# EAGLE design RC_MUX (EAGLE 6.4)
DATABASE: /home/mes/eagle/PARTSDB.txt
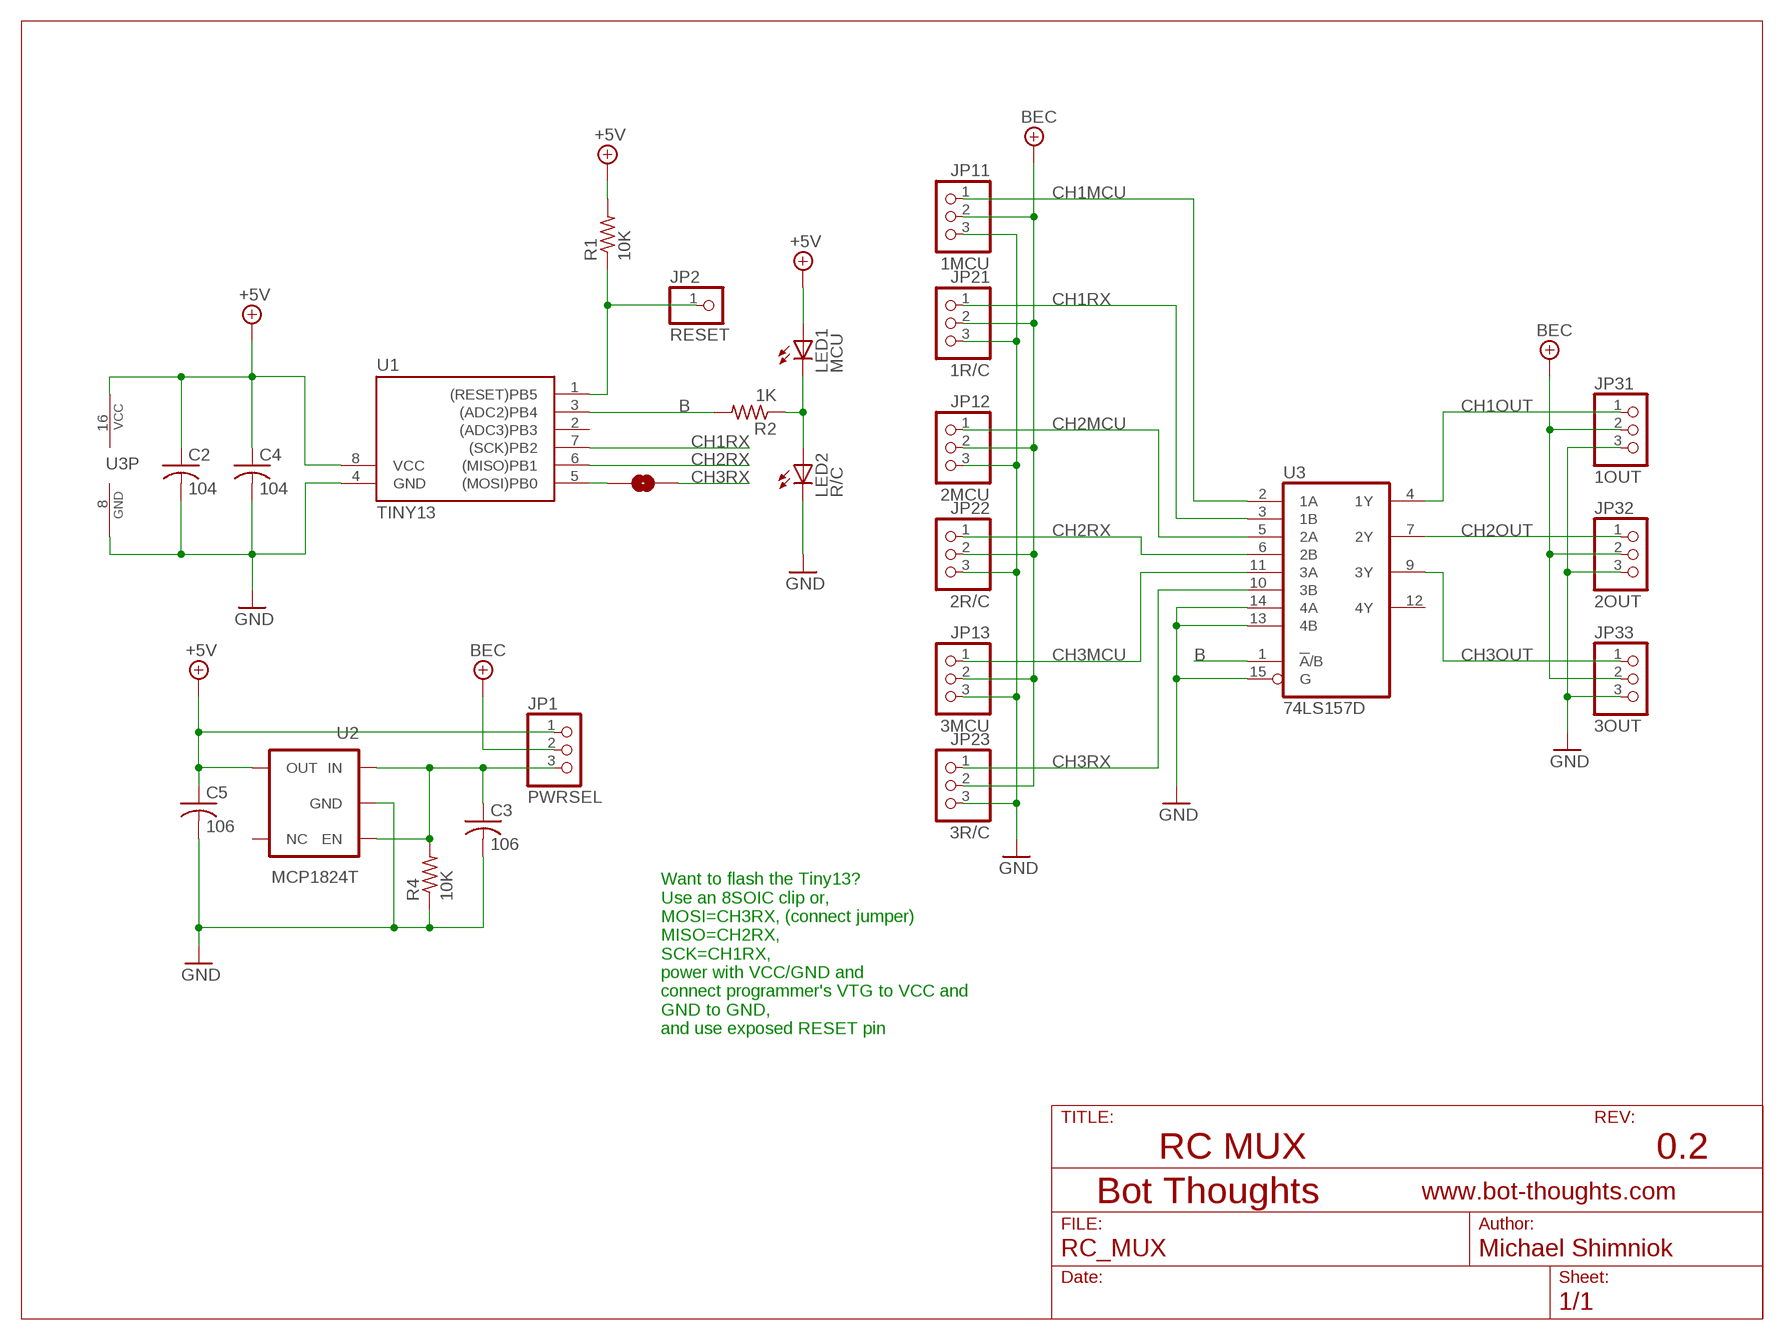
[diagram p0: schematic, sheet 1]

## Parts
C2  104  C-USC0603  [C0603]
C3  106  C-USC0603  [C0603]
C4  104  C-USC0603  [C0603]
C5  106  C-USC0603  [C0603]
JP1  PWRSEL  PINHD-1X03_2.00  [1X03M]
JP2  RESET  PINHD-1X01_2.54-S  [1X01-S]
JP11  1MCU  PINHD-1X03_2.54-S  [1X03-S]
JP12  2MCU  PINHD-1X03_2.54-S  [1X03-S]
JP13  3MCU  PINHD-1X03_2.54-S  [1X03-S]
JP21  1R/C  PINHD-1X03_2.54-S  [1X03-S]
JP22  2R/C  PINHD-1X03_2.54-S  [1X03-S]
JP23  3R/C  PINHD-1X03_2.54-S  [1X03-S]
JP31  1OUT  PINHD-1X03_2.54-S  [1X03-S]
JP32  2OUT  PINHD-1X03_2.54-S  [1X03-S]
JP33  3OUT  PINHD-1X03_2.54-S  [1X03-S]
LED1  MCU  LEDCHIPLED_1206  [CHIPLED_1206]
LED2  R/C  LEDCHIPLED_1206  [CHIPLED_1206]
R1  10K  R-US_R0603  [R0603]
R2  1K  R-US_R0603  [R0603]
R4  10K  R-US_R0603  [R0603]
SJ1  CH3  SOLDERJUMPERNC2  [SJ_2S-NOTRACE]
U1  TINY13  TINY138S2  [SO08]
U2  MCP1824T  MCP1801  [SOT23-5]
U3  74LS157D  [SO16]

## Nets
!RESET: JP2.1 R1.1 U1.1((RESET)PB5)
+5V: C2.1 C4.1 C5.1 JP1.1 LED1.A R1.2 U1.8(VCC) U2.5(OUT) U3.16(VCC)
+7V: JP1.2 JP11.2 JP12.2 JP13.2 JP21.2 JP22.2 JP23.2 JP31.2 JP32.2 JP33.2 ; supply symbol labelled BEC
B: R2.2 U1.3((ADC2)PB4) U3.1(!A!/B)
CH1MCU: JP11.1 U3.2(1A)
CH1OUT: JP31.1 U3.4(1Y)
CH1RX: JP21.1 U1.7((SCK)PB2) U3.3(1B)
CH2MCU: JP12.1 U3.5(2A)
CH2OUT: JP32.1 U3.7(2Y)
CH2RX: JP22.1 U1.6((MISO)PB1) U3.6(2B)
CH3MCU: JP13.1 U3.11(3A)
CH3OUT: JP33.1 U3.9(3Y)
CH3RX: JP23.1 SJ1.2 U3.10(3B)
GND: C2.2 C3.2 C4.2 C5.2 JP11.3 JP12.3 JP13.3 JP21.3 JP22.3 JP23.3 JP31.3 JP32.3 JP33.3 LED2.C R4.1 U1.4(GND) U2.2(GND) U3.8(GND) U3.13(4B) U3.14(4A) U3.15(G)
LEDS: LED1.C LED2.A R2.1
N$1: SJ1.1 U1.5((MOSI)PB0)
REGIN: C3.1 JP1.3 R4.2 U2.1(IN) U2.3(EN)
Unconnected: U1.2((ADC3)PB3) U2.4(NC) U3.12(4Y)

## Notes on the sheet
- Want to flash the Tiny13?
  Use an 8SOIC clip or, 
  MOSI=CH3RX, (connect jumper)
  MISO=CH2RX, 
  SCK=CH1RX, 
  power with VCC/GND and 
  connect programmer's VTG to VCC and
  GND to GND,
  and use exposed RESET pin
- RC MUX | 0.2

## Library data of the parts
C2 C4 = rcl:C-US: CAPACITOR, American symbol; PARTNO: C1608X7R1E104K080AA
C3 C5 = rcl:C-US: CAPACITOR, American symbol; PARTNO: CL10A106MP8NNNC
JP1 JP11-JP13 JP21-JP23 JP31-JP33 = pinhead-2:PINHD-1X03: PIN HEADER
JP2 = pinhead-2:PINHD-1X01: PIN HEADER
LED1 = led:LED: LED OSRAM: - CHIPLED LG R971, LG N971, LY N971, LG Q971, LY Q971, LO R971, LY R971 LH N974, LH R974 LS Q976, LO Q976, LY Q976 LO Q996 - Hyper CHIPLED LW Q18S LB Q993, LB Q99A, LB R99A - SideLED LS A670, LO A670, LY A670, LG A670, LP A670 LB A673, LV A673, LT A673, LW A673 LH A674 LY A675 LS A676, LA A676, LO A676, LY A676, LW A676 LS A679, LY A679, LG A679 - Hyper Micro SIDELED® LS Y876, LA Y876, LO Y876, LY Y876 LT Y87S - SmartLED LW L88C, LW L88S LB L89C, LB L89S, LG L890 LS L89K, LO L89K, LY L89K LS L896, LA L896, LO L896, LY L896 - TOPLED LS T670, LO T670, LY T670, LG T670, LP T670 LSG T670, LSP T670, LSY T670, LOP T670, LYG T670 LG T671, LOG T671, LSG T671 LB T673, LV T673, LT T673, LW T673 LH T674 LS T676, LA T676, LO T676, LY T676, LB T676, LH T676, LSB T676, LW T676 LB T67C, LV T67C, LT T67C, LS T67K, LO T67K, LY T67K, LW E67C LS E67B, LA E67B, LO E67B, LY E67B, LB E67C, LV E67C, LT E67C LW T67C LS T679, LY T679, LG T679 LS T770, LO T770, LY T770, LG T770, LP T770 LB T773, LV T773, LT T773, LW T773 LH T774 LS E675, LA E675, LY E675, LS T675 LS T776, LA T776, LO T776, LY T776, LB T776 LHGB T686 LT T68C, LB T68C - Hyper Mini TOPLED® LB M676 - Mini TOPLED Santana® LG M470 LS M47K, LO M47K, LY M47K Source: http://www.osram.convergy.de LUXEON: - LUMILED® LXK2-PW12-R00, LXK2-PW12-S00, LXK2-PW14-U00, LXK2-PW14-V00 LXK2-PM12-R00, LXK2-PM12-S00, LXK2-PM14-U00 LXK2-PE12-Q00, LXK2-PE12-R00, LXK2-PE12-S00, LXK2-PE14-T00, LXK2-PE14-U00 LXK2-PB12-K00, LXK2-PB12-L00, LXK2-PB12-M00, LXK2-PB14-N00, LXK2-PB14-P00, LXK2-PB14-Q00 LXK2-PR12-L00, LXK2-PR12-M00, LXK2-PR14-Q00, LXK2-PR14-R00 LXK2-PD12-Q00, LXK2-PD12-R00, LXK2-PD12-S00 LXK2-PH12-R00, LXK2-PH12-S00 LXK2-PL12-P00, LXK2-PL12-Q00, LXK2-PL12-R00 Source: www.luxeon.com KINGBRIGHT: KA-3528ASYC Source: www.kingbright.com; PARTNO: LH N974-KN-1
LED2 = led:LED: LED OSRAM: - CHIPLED LG R971, LG N971, LY N971, LG Q971, LY Q971, LO R971, LY R971 LH N974, LH R974 LS Q976, LO Q976, LY Q976 LO Q996 - Hyper CHIPLED LW Q18S LB Q993, LB Q99A, LB R99A - SideLED LS A670, LO A670, LY A670, LG A670, LP A670 LB A673, LV A673, LT A673, LW A673 LH A674 LY A675 LS A676, LA A676, LO A676, LY A676, LW A676 LS A679, LY A679, LG A679 - Hyper Micro SIDELED® LS Y876, LA Y876, LO Y876, LY Y876 LT Y87S - SmartLED LW L88C, LW L88S LB L89C, LB L89S, LG L890 LS L89K, LO L89K, LY L89K LS L896, LA L896, LO L896, LY L896 - TOPLED LS T670, LO T670, LY T670, LG T670, LP T670 LSG T670, LSP T670, LSY T670, LOP T670, LYG T670 LG T671, LOG T671, LSG T671 LB T673, LV T673, LT T673, LW T673 LH T674 LS T676, LA T676, LO T676, LY T676, LB T676, LH T676, LSB T676, LW T676 LB T67C, LV T67C, LT T67C, LS T67K, LO T67K, LY T67K, LW E67C LS E67B, LA E67B, LO E67B, LY E67B, LB E67C, LV E67C, LT E67C LW T67C LS T679, LY T679, LG T679 LS T770, LO T770, LY T770, LG T770, LP T770 LB T773, LV T773, LT T773, LW T773 LH T774 LS E675, LA E675, LY E675, LS T675 LS T776, LA T776, LO T776, LY T776, LB T776 LHGB T686 LT T68C, LB T68C - Hyper Mini TOPLED® LB M676 - Mini TOPLED Santana® LG M470 LS M47K, LO M47K, LY M47K Source: http://www.osram.convergy.de LUXEON: - LUMILED® LXK2-PW12-R00, LXK2-PW12-S00, LXK2-PW14-U00, LXK2-PW14-V00 LXK2-PM12-R00, LXK2-PM12-S00, LXK2-PM14-U00 LXK2-PE12-Q00, LXK2-PE12-R00, LXK2-PE12-S00, LXK2-PE14-T00, LXK2-PE14-U00 LXK2-PB12-K00, LXK2-PB12-L00, LXK2-PB12-M00, LXK2-PB14-N00, LXK2-PB14-P00, LXK2-PB14-Q00 LXK2-PR12-L00, LXK2-PR12-M00, LXK2-PR14-Q00, LXK2-PR14-R00 LXK2-PD12-Q00, LXK2-PD12-R00, LXK2-PD12-S00 LXK2-PH12-R00, LXK2-PH12-S00 LXK2-PL12-P00, LXK2-PL12-Q00, LXK2-PL12-R00 Source: www.luxeon.com KINGBRIGHT: KA-3528ASYC Source: www.kingbright.com; PARTNO: LG N971-KN-1
R1 R4 = rcl:R-US_: RESISTOR, American symbol; PARTNO: 1622829-1
R2 = rcl:R-US_: RESISTOR, American symbol; PARTNO: RC0603JR-07330RL
SJ1 = SparkFun:SOLDERJUMPER: Solder Jumper Standard SMD solder jumper. Used to automate production. Two varients : Normally Open and Normally Closed are the same, but have different paste layers. NC will have a large amount of paste and should jumper during reflow.
U1 = avr-7:TINY13*; PARTNO: ATTINY13A-SSH
U2 = mes_regulators:MCP1801: Microchip MCP1801 LDO Regulator The MCP1801 is a family of CMOS low dropout (LDO) voltage regulators that can deliver up to 150 mA of current while consuming only 25 μA of quiescent current (typical) with input operating range from 2.0V to 10.0V. Datasheet.pdf <http://ww1.microchip.com/downloads/en/DeviceDoc/22051D.pdf>; PARTNO: MCP1824T-5002E/OT
U3 = 74xx-us:74*157: Quadruple 2-line to 1-line data SELECTOR/MULTIPLEXER; PARTNO: 74HCT157D,652

## Board
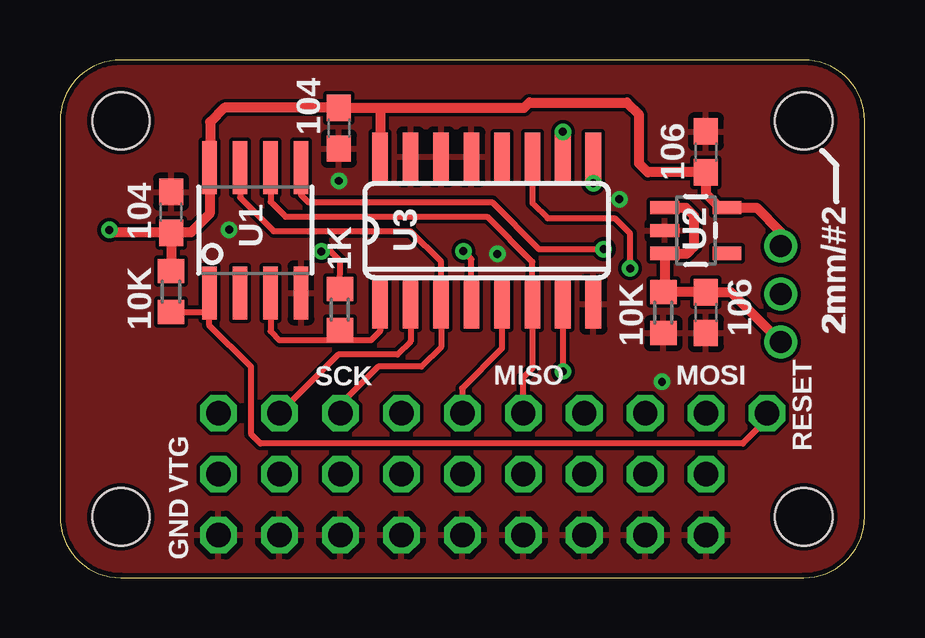
[diagram p1: board, top side]
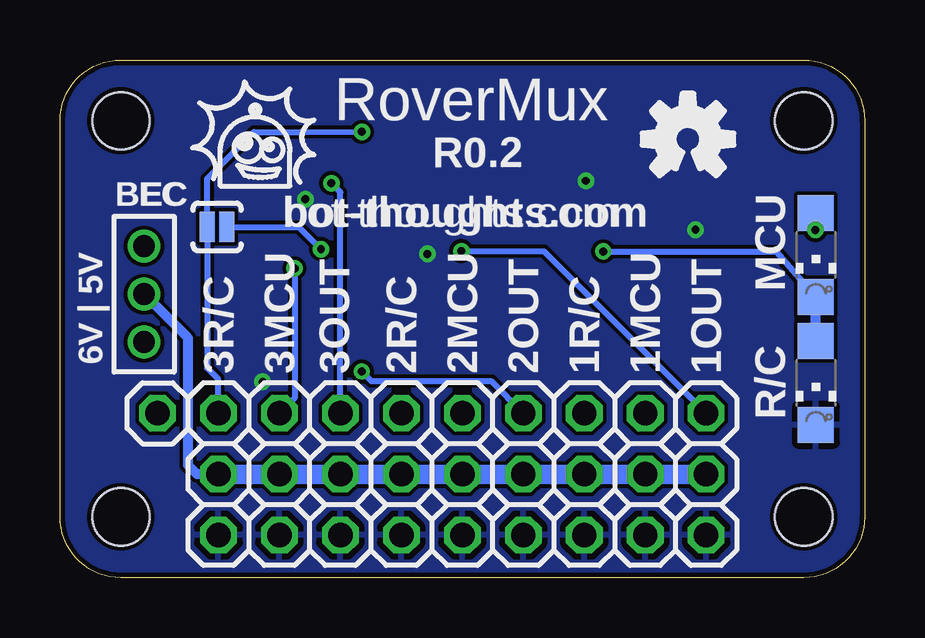
[diagram p2: board, bottom side, seen from below]

Size 33.53 x 21.59 mm. Coordinates in mm from the lower left corner, seen from the top.
Outline: 30.99,21.59 2.54,21.59 arc90 0,19.05 0,2.54 arc90 2.54,0 30.99,0 arc90 33.53,2.54 33.53,19.05 arc90 30.99,21.59
Copper layers (1*16): Top 0.0356mm / dielectric 1.5011mm / Bottom 0.0356mm
Design rules "LaenPCBOrder *": minimum track width 6mil, minimum drill 13mil, track to track 6mil, track to pad 6mil, pad to pad 6mil, via to via 6mil, smd to smd 6mil, copper to edge 8mil, drill to drill 6mil, minimum pad ring 7mil, minimum via ring 7mil, stop-mask expansion 4mil, vias tented up to drill 20mil, thermal gap 10mil
Holes 2.39 mm at 30.99,2.54 30.99,19.05 2.54,2.54 2.54,19.05

### Footprints (pad centres in the part's own frame; a part is rotated, then mirrored left to right if it is on the bottom)
C0603 = smd 1.1 x 1: 1 -0.85,0; 2 0.85,0
1X03M = drill 0.914: 1 -2,0; 2 0,0; 3 2,0
1X01-S = drill 1.016 octagon: 1 0,0
1X03-S = drill 1.016 octagon: 1 -2.54,0; 2 0,0; 3 2.54,0
CHIPLED_1206 = smd 1.5 x 1.5: A 0,-1.75; C 0,1.75
R0603 = smd 1 x 1.1: 1 -0.85,0; 2 0.85,0
SJ_2S-NOTRACE = smd 0.635 x 1.27: 1 -0.401,0; 2 0.413,0
SO08 = smd 0.61 x 2.21: 1 -1.905,-2.616; 2 -0.635,-2.616; 3 0.635,-2.616; 4 1.905,-2.616; 5 1.905,2.616; 6 0.635,2.616; 7 -0.635,2.616; 8 -1.905,2.616
SOT23-5 = smd 0.55 x 1.2: 1 -0.95,-1.3; 2 0,-1.3; 3 0.95,-1.3; 4 0.95,1.3; 5 -0.95,1.3
SO16 = smd 0.66 x 2.032: 1 -4.445,-3.073; 2 -3.175,-3.073; 3 -1.905,-3.073; 4 -0.635,-3.073; 5 0.635,-3.073; 6 1.905,-3.073; 7 3.175,-3.073; 8 4.445,-3.073; 9 4.445,3.073; 10 3.175,3.073; 11 1.905,3.073; 12 0.635,3.073; 13 -0.635,3.073; 14 -1.905,3.073; 15 -3.175,3.073; 16 -4.445,3.073

### Placement (x,y rotation side)
C2  4.63,15.24 90 top
C3  26.92,11.05 270 top
C4  11.62,18.74 270 top
C5  26.92,17.75 90 top
JP1  30.03,11.82 270 bottom
JP2  29.46,6.86 90 bottom
JP11  9.14,4.32 270 bottom
JP12  16.76,4.32 270 bottom
JP13  24.38,4.32 270 bottom
JP21  11.68,4.32 270 bottom
JP22  19.3,4.32 270 bottom
JP23  26.92,4.32 270 bottom
JP31  6.6,4.32 270 bottom
JP32  14.22,4.32 270 bottom
JP33  21.84,4.32 270 bottom
LED1  2.03,13.46 180 bottom
LED2  2.03,8.13 180 bottom
R1  4.63,11.94 90 top
R2  11.66,11.18 270 top
R4  25.14,11.05 90 top
SJ1  26.98,14.63 180 bottom
U1  8.14,14.49 0 top
U2  26.49,14.48 270 top
U3  17.78,14.48 0 top

### Tracks (layer width: path | path; a pad name or v marks a point on that pad's centre or on a via)
!RESET
  Top 0.254: JP2.1 29.36,6.51 28.45,5.6 8.35,5.6 7.95,6 7.95,8.8 6.21,10.55 6.21,11.1 6.21,11.85 | R1.1 6.2,11.09
  Top 0.406: 6.21,11.85 U1.1 | 6.2,11.09 6.21,11.1
+5V  (via drill 0.33)
  Top 0.406: C2.1 R1.2 | 13.33,19.59 C4.1 6.85,19.59 6.25,19 6.25,17.13 U1.8 6.23,15.18 5.45,14.4 4.64,14.4 C2.1 | 13.33,19.59 U3.16 | 13.33,19.59 19.34,19.59 19.56,19.81 23.62,19.81 24.13,19.3 24.13,17.27 24.5,16.9 C5.1 26.92,16 27.46,15.46 27.76,15.46 U2.5 29.02,15.43 30.03,14.42 JP1.1 | C2.1 2.16,14.39 v2.05,14.5
  Bottom 0.406: LED1.A 2.03,15.02 v2.05,14.5
+7V
  Bottom 0.406: JP23.2 27.82,4.32 28.19,4.69 28.19,9.99 JP1.2
  Bottom 0.813: JP23.2 JP13.2 JP33.2 JP22.2 JP12.2 JP32.2 JP21.2 JP11.2 JP31.2
B
  Top 0.254: U3.1 13.33,10.28 12.95,9.9 11.65,9.9 | 11.65,9.9 9.15,9.9 8.77,10.28 U1.3 | R2.2 11.66,9.91 11.65,9.9
CH1MCU
  Top 0.254: U3.2 14.61,9.85 14.05,9.3 11.59,9.3 JP11.1
CH1OUT  (via drill 0.33)
  Top 0.254: U3.4 17.14,13.28 v16.81,13.62
  Bottom 0.254: v16.81,13.62 13.36,13.62 JP31.1
CH1RX
  Top 0.254: U1.7 7.5,15.85 8.9,14.45 14.6,14.45 15.88,13.18 U3.3 15.88,9.62 15.05,8.8 13.25,8.8 11.68,7.23 JP21.1
CH2MCU
  Top 0.254: U3.5 18.42,9.56 16.75,7.9 JP12.1
CH2OUT  (via drill 0.33)
  Top 0.254: U3.7 v20.96,8.6
  Bottom 0.254: v20.96,8.6 20.55,8.2 15.57,8.2 JP32.1
CH2RX
  Top 0.254: U1.6 8.77,15.68 9.4,15.05 17.8,15.05 19.69,13.17 U3.6 19.69,8.73 19.3,8.35 JP22.1
CH3MCU  (via drill 0.33)
  Top 0.254: U3.11 19.69,15.62 20.32,14.99 23.11,14.99 23.75,14.35 v23.75,12.9
  Bottom 0.254: v23.75,12.9 23.75,7.49 JP13.1
CH3OUT  (via drill 0.33)
  Top 0.254: v22.22,16.45 U3.9
  Bottom 0.254: JP33.1 21.84,16.07 v22.22,16.45
CH3RX  (via drill 0.33)
  Top 0.254: v20.95,18.59 U3.10
  Bottom 0.254: v20.95,18.59 23.49,18.58 25.45,18.58 27.4,16.63 SJ1.2 27.4,8.74 26.95,8.3 26.95,6.89 JP23.1
GND  (via drill 0.33)
  other vias: 18.22,13.5 7.05,14.52 25.08,8.17 11.62,16.55 23.3,15.79
  pour Top: 2.54,21.59 30.99,21.59 arc-90 33.53,19.05 33.53,2.54 arc-90 30.99,0 2.54,0 arc-90 0,2.54 0,19.05 arc-90
  pour Bottom: 2.54,21.59 30.99,21.59 arc-90 33.53,19.05 33.53,2.54 arc-90 30.99,0 2.54,0 arc-90 0,2.54 0,19.05 arc-90
LEDS  (via drill 0.33)
  Top 0.254: R2.1 11.68,13.21 11.28,13.61 v10.89,13.61
  Bottom 0.254: v10.89,13.61 3.67,13.61 LED1.C
  Bottom 0.406: LED2.A LED1.C
N$1  (via drill 0.33)
  Top 0.254: U1.5 10.04,15.96 10.35,15.65 18,15.65 19.95,13.7 v22.65,13.7
  Bottom 0.254: SJ1.1 23.58,14.63 v22.65,13.7
REGIN
  Top 0.406: U2.1 26.08,15.43 26.41,15.1 26.41,13.8 26.11,13.5 25.02,13.5 U2.3 25.19,11.85 R4.2 C3.1 27.95,11.9 JP1.3

### Text on the board
tPlace: 2mm/#2
bPlace: BEC | 6V | 5V
tNames: SCK | MISO | MOSI | VTG | GND
bNames: RoverMux | R0.2 | bot-thoughts.com
tsilk: 104 | 106 | U1 | 2mm/#2 | U3 | U2 | 104 | 1K | 106 | 10K | 10K | SCK | MISO | MOSI | RESET | VTG | GND
bsilk: RoverMux | R0.2 | bot-thoughts.com | BEC | MCU | 1OUT | 1MCU | 1R/C | 2OUT | 2MCU | 2R/C | 3OUT | 3MCU | 3R/C | 6V | 5V | R/C